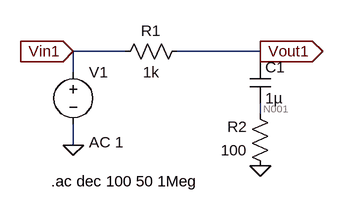
[diagram p0: schematic Prob_1c.asc]
Prob_1c.asc, the LTspice schematic file:
Version 4
SHEET 1 880 680
WIRE 144 -16 64 -16
WIRE 352 -16 224 -16
WIRE 352 0 352 -16
WIRE 64 16 64 -16
WIRE 352 80 352 64
WIRE 64 128 64 96
FLAG 64 128 0
FLAG 352 160 0
FLAG 64 -16 Vin1
IOPIN 64 -16 In
FLAG 352 -16 Vout1
IOPIN 352 -16 Out
SYMBOL voltage 64 0 R0
WINDOW 123 24 124 Left 2
WINDOW 39 0 0 Left 0
SYMATTR InstName V1
SYMATTR Value ""
SYMATTR Value2 AC 1
SYMBOL res 240 -32 R90
WINDOW 0 0 56 VBottom 2
WINDOW 3 32 56 VTop 2
SYMATTR InstName R1
SYMATTR Value 1k
SYMBOL res 368 176 R180
WINDOW 0 36 76 Left 2
WINDOW 3 36 40 Left 2
SYMATTR InstName R2
SYMATTR Value 100
SYMBOL cap 336 0 R0
SYMATTR InstName C1
SYMATTR Value 1µ
TEXT 30 184 Left 2 !.ac dec 100 50 1Meg

The netlist it stands for:
* Prob_1c.asc
V1 Vin1 0 AC 1
R1 Vout1 Vin1 1k
R2 0 N001 100
C1 Vout1 N001 1µ
.ac dec 100 50 1Meg
.backanno
.end

* Results of the author's LTspice run, read from the files saved beside the schematic
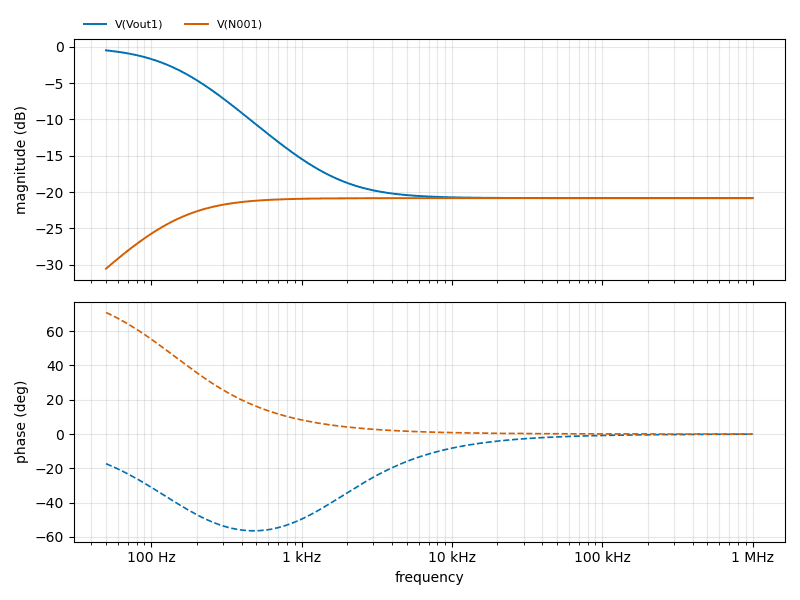
[diagram p1: AC Analysis of Prob_1c.asc, plotted from the saved traces]
* AC Analysis, 1 run:
*   V(Vout1): -0.49 dB at 50 Hz, -20.83 dB at 1 MHz, peak -0.49 dB at 50 Hz, 3 dB below the peak at 162.4 Hz
*   V(N001): -30.55 dB at 50 Hz, -20.83 dB at 1 MHz, peak -20.83 dB at 1 MHz, 3 dB below the peak at 144.7 Hz